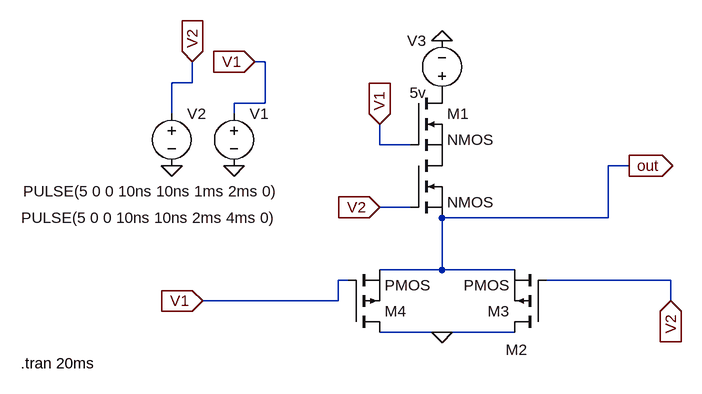
[diagram p0: schematic test3.asc]
test3.asc, the LTspice schematic file:
Version 4
SHEET 1 1120 680
WIRE 112 48 96 48
WIRE 0 80 0 48
WIRE 0 80 -32 80
WIRE 112 112 112 48
WIRE 112 112 64 112
WIRE -32 128 -32 80
WIRE 64 128 64 112
WIRE 288 176 288 144
WIRE 336 176 288 176
WIRE 672 208 640 208
WIRE 336 272 288 272
WIRE 640 288 640 208
WIRE 640 288 384 288
WIRE 384 368 384 288
WIRE 384 368 288 368
WIRE 496 368 384 368
WIRE 240 384 224 384
WIRE 736 384 544 384
WIRE 224 416 224 384
WIRE 224 416 16 416
WIRE 736 416 736 384
WIRE 384 464 288 464
WIRE 496 464 384 464
FLAG -32 208 0
FLAG 64 208 0
FLAG 384 16 0
FLAG 672 208 out
IOPIN 672 208 Out
FLAG 288 144 V1
IOPIN 288 144 In
FLAG 16 416 V1
IOPIN 16 416 In
FLAG 0 48 V2
IOPIN 0 48 In
FLAG 288 272 V2
IOPIN 288 272 In
FLAG 96 48 V1
IOPIN 96 48 In
FLAG 736 416 V2
IOPIN 736 416 In
FLAG 384 464 0
SYMBOL voltage 64 112 R0
WINDOW 3 -324 135 Left 2
WINDOW 123 0 0 Left 0
WINDOW 39 0 0 Left 0
SYMATTR InstName V1
SYMATTR Value PULSE(5 0 0 10ns 10ns 1ms 2ms 0)
SYMBOL voltage -32 112 R0
WINDOW 3 -231 176 Left 2
WINDOW 123 0 0 Left 0
WINDOW 39 0 0 Left 0
SYMATTR InstName V2
SYMATTR Value PULSE(5 0 0 10ns 10ns 2ms 4ms 0)
SYMBOL voltage 384 112 R180
WINDOW 0 24 96 Left 2
WINDOW 3 24 16 Left 2
WINDOW 123 0 0 Left 0
WINDOW 39 0 0 Left 0
SYMATTR InstName V3
SYMATTR Value 5v
SYMBOL nmos 336 192 R0
WINDOW 0 146 299 Left 2
SYMATTR InstName M2
SYMBOL pmos 544 464 R180
SYMATTR InstName M3
SYMBOL pmos 240 464 M180
SYMATTR InstName M4
SYMBOL nmos 336 96 R0
SYMATTR InstName M1
TEXT -264 512 Left 2 !.tran 20ms

The netlist it stands for:
* test3.asc
V1 V1 0 PULSE(5 0 0 10ns 10ns 1ms 2ms 0)
V2 V2 0 PULSE(5 0 0 10ns 10ns 2ms 4ms 0)
V3 P001 0 5v
M2 P002 V2 out out NMOS
M3 0 V2 out out PMOS
M4 0 V1 out out PMOS
M1 P001 V1 P002 P002 NMOS
.model NMOS NMOS
.model PMOS PMOS
.lib standard.mos
.tran 20ms
.backanno
.end